# EAGLE design haasoscope_triggerout_board (EAGLE 9.6.2)
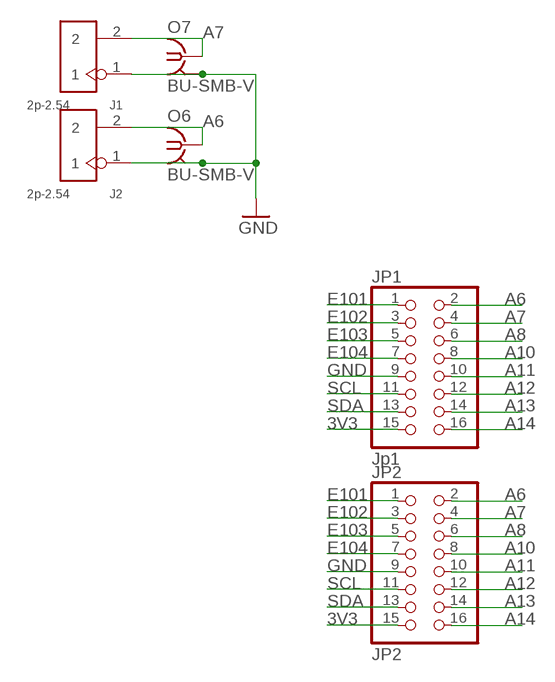
[diagram p0: schematic, sheet 1]

## Parts
J1  2p-2.54  DIP-BLACK-MALE-HEADER-VERT(2P-2.54)  [H2-2.54]
J2  2p-2.54  DIP-BLACK-MALE-HEADER-VERT(2P-2.54)  [H2-2.54]
JP1  Jp1  PINHD-2X8  [2X08]
JP2  JP2  PINHD-2X8  [2X08]
O6  BU-SMB-V  [BU-SMB-V]
O7  BU-SMB-V  [BU-SMB-V]

## Nets
3V3: JP1.15 JP2.15
A6: J2.2 JP1.2 JP2.2 O6.1
A7: J1.2 JP1.4 JP2.4 O7.1
A8: JP1.6 JP2.6
A10: JP1.8 JP2.8
A11: JP1.10 JP2.10
A12: JP1.12 JP2.12
A13: JP1.14 JP2.14
A14: JP1.16 JP2.16
E101: JP1.1 JP2.1
E102: JP1.3 JP2.3
E103: JP1.5 JP2.5
E104: JP1.7 JP2.7
GND: J1.1 J2.1 JP1.9 JP2.9 O6.2 O6.3 O6.4 O6.5 O7.2 O7.3 O7.4 O7.5
SCL: JP1.11 JP2.11
SDA: JP1.13 JP2.13

## Library data of the parts
J1 J2 = Seeed-Connector:DIP-BLACK-MALE-HEADER-VERT(2P-2.54): 320020016; MPN: P125-1102A0BS116A1
JP1 JP2 = pinhead:PINHD-2X8: PIN HEADER
O6 O7 = con-coax:BU-SMB-V: FEMALE SMB CONNECTOR Radiall distributor RS 112-2993; OC_FARNELL: unknown; OC_NEWARK: unknown

## Net classes
0 default: width 0.508 mm

## Board
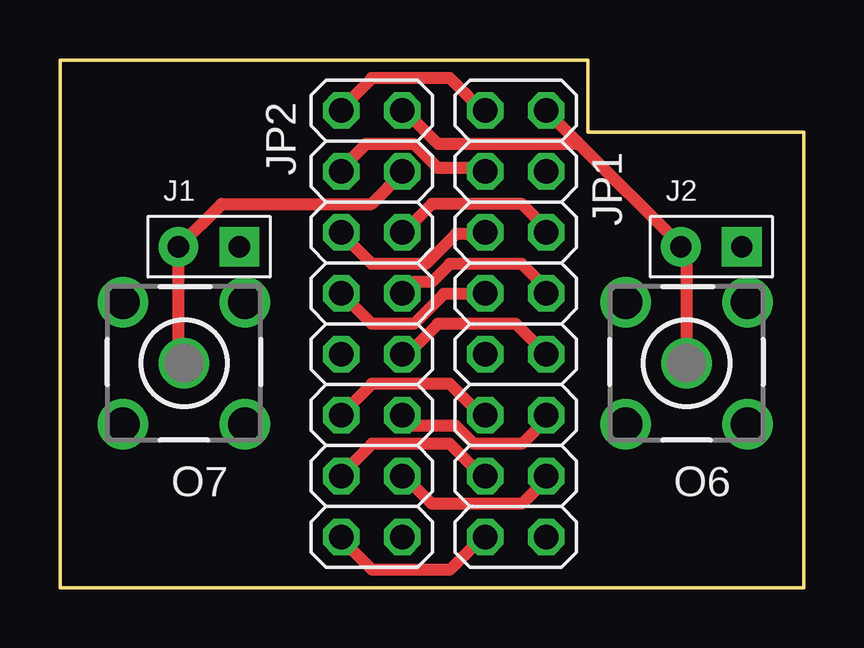
[diagram p1: board, top side]
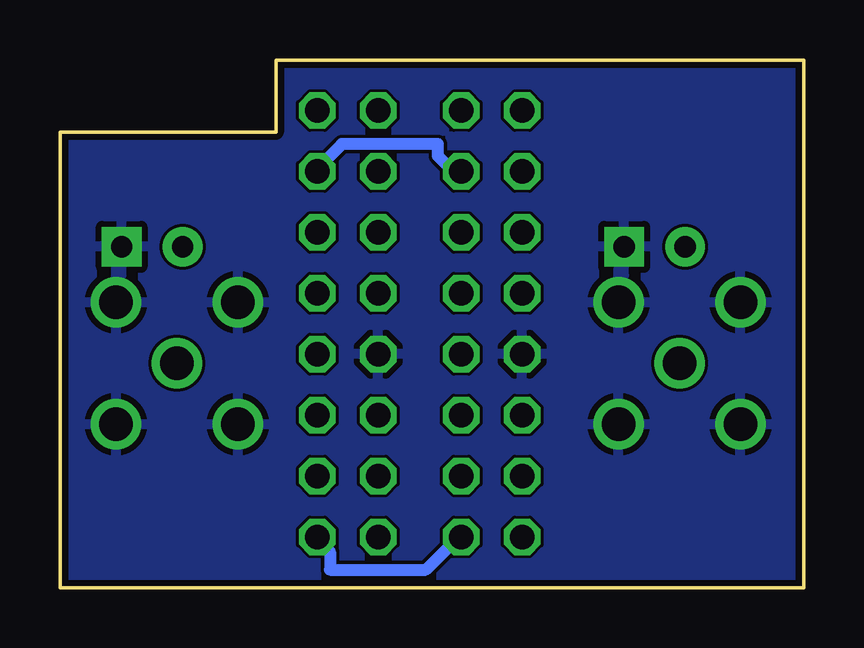
[diagram p2: board, bottom side, seen from below]

Size 31 x 22 mm. Coordinates in mm from the lower left corner, seen from the top.
Outline: 0,0 0,22 22,22 22,19 31,19 31,0 0,0
Copper layers (1*16): Top 0.035mm / dielectric 1.5mm / Bottom 0.035mm
Design rules "MF_Standard_2_Layer": minimum track width 5mil, minimum drill 12mil, track to track 5mil, track to pad 5mil, pad to pad 5mil, via to via 5mil, smd to smd 0mil, copper to edge 10mil, drill to drill 10mil, minimum pad ring 6mil, minimum via ring 6mil, stop-mask expansion 2mil, vias tented up to drill 25mil, thermal gap 10mil

### Footprints (pad centres in the part's own frame; a part is rotated, then mirrored left to right if it is on the bottom)
H2-2.54 = drill 0.889 pad 1.651 square: 1 0,1.27 | drill 0.889 pad 1.651: 2 0,-1.27
2X08 = drill 1.016 octagon: 1 -8.89,-1.27; 2 -8.89,1.27; 3 -6.35,-1.27; 4 -6.35,1.27; 5 -3.81,-1.27; 6 -3.81,1.27; 7 -1.27,-1.27; 8 -1.27,1.27; 9 1.27,-1.27; 10 1.27,1.27; 11 3.81,-1.27; 12 3.81,1.27; 13 6.35,-1.27; 14 6.35,1.27; 15 8.89,-1.27; 16 8.89,1.27
BU-SMB-V = drill 1.4: 1 0,0; 2 -2.54,2.54; 3 2.54,2.54; 4 2.54,-2.54; 5 -2.54,-2.54

### Placement (x,y rotation side)
J1  6.21,14.21 270 top
J2  27.16,14.21 270 top
JP1  19,11 270 top
JP2  13,11 270 top
O6  26.12,9.35 0 top
O7  5.17,9.35 0 top

### Tracks (layer width: path | path; a pad name or v marks a point on that pad's centre or on a via)
3V3
  Top 0.508: JP2.15 11.75,2 13,0.75 16.25,0.75 17.5,2 JP1.15
A6
  Top 0.508: JP1.2 21.58,18.58 | 21.58,18.58 25.89,14.27 J2.2 26.12,13.98 O6.1 | JP2.2 14.5,19.75 15.75,18.5 21.5,18.5 21.58,18.58
A7
  Top 0.508: O7.1 4.94,9.58 J1.2 6.73,16 13,16 14.27,17.27 JP2.4
  Bottom 0.508: JP1.4 20.25,17.5 19.25,18.5 15.25,18.5 15.25,18 14.5,17.25 JP2.4
A8
  Top 0.508: JP2.6 14.5,15 15.5,16 19.25,16 20.25,15 JP1.6
A10
  Top 0.508: JP2.8 14.75,12.75 15.5,12.75 16.25,13.5 19.25,13.5 20.25,12.5 JP1.8
A11
  Top 0.508: JP1.10 19,11 15.75,11 14.5,9.75 JP2.10
A12
  Top 0.508: JP2.12 14.5,7 14.75,6.75 16.5,6.75 17.25,6 19.25,6 20.25,7 JP1.12
A13
  Top 0.508: JP2.14 14.5,4.5 15.5,3.5 19.25,3.5 20.25,4.5 JP1.14
A14
  Bottom 0.508: JP2.16 14.5,2 15.75,0.75 19.75,0.75 19.75,1.5 20.25,2 JP1.16
E101
  Top 0.508: JP2.1 11.75,20 13,21.25 16.25,21.25 17.5,20 JP1.1
E102
  Top 0.508: JP2.3 11.75,17.5 12.75,18.5 14.75,18.5 15.75,17.5 17.5,17.5 JP1.3
E103
  Top 0.508: JP2.5 11.75,14.75 13,13.5 15.25,13.5 16.5,14.75 17.5,14.75 JP1.5
E104
  Top 0.508: JP2.7 13,11 14.75,11 16,12.25 17.5,12.25 JP1.7
GND
  pour Bottom: 0,22 32,22 32,0 0,0
SCL
  Top 0.508: JP2.11 11.75,7.25 13,8.5 16.25,8.5 17.5,7.25 JP1.11
SDA
  Top 0.508: JP2.13 11.75,4.75 13,6 16.25,6 17.5,4.75 JP1.13